# EAGLE design arm_pcb2020 (EAGLE 9.4.2)
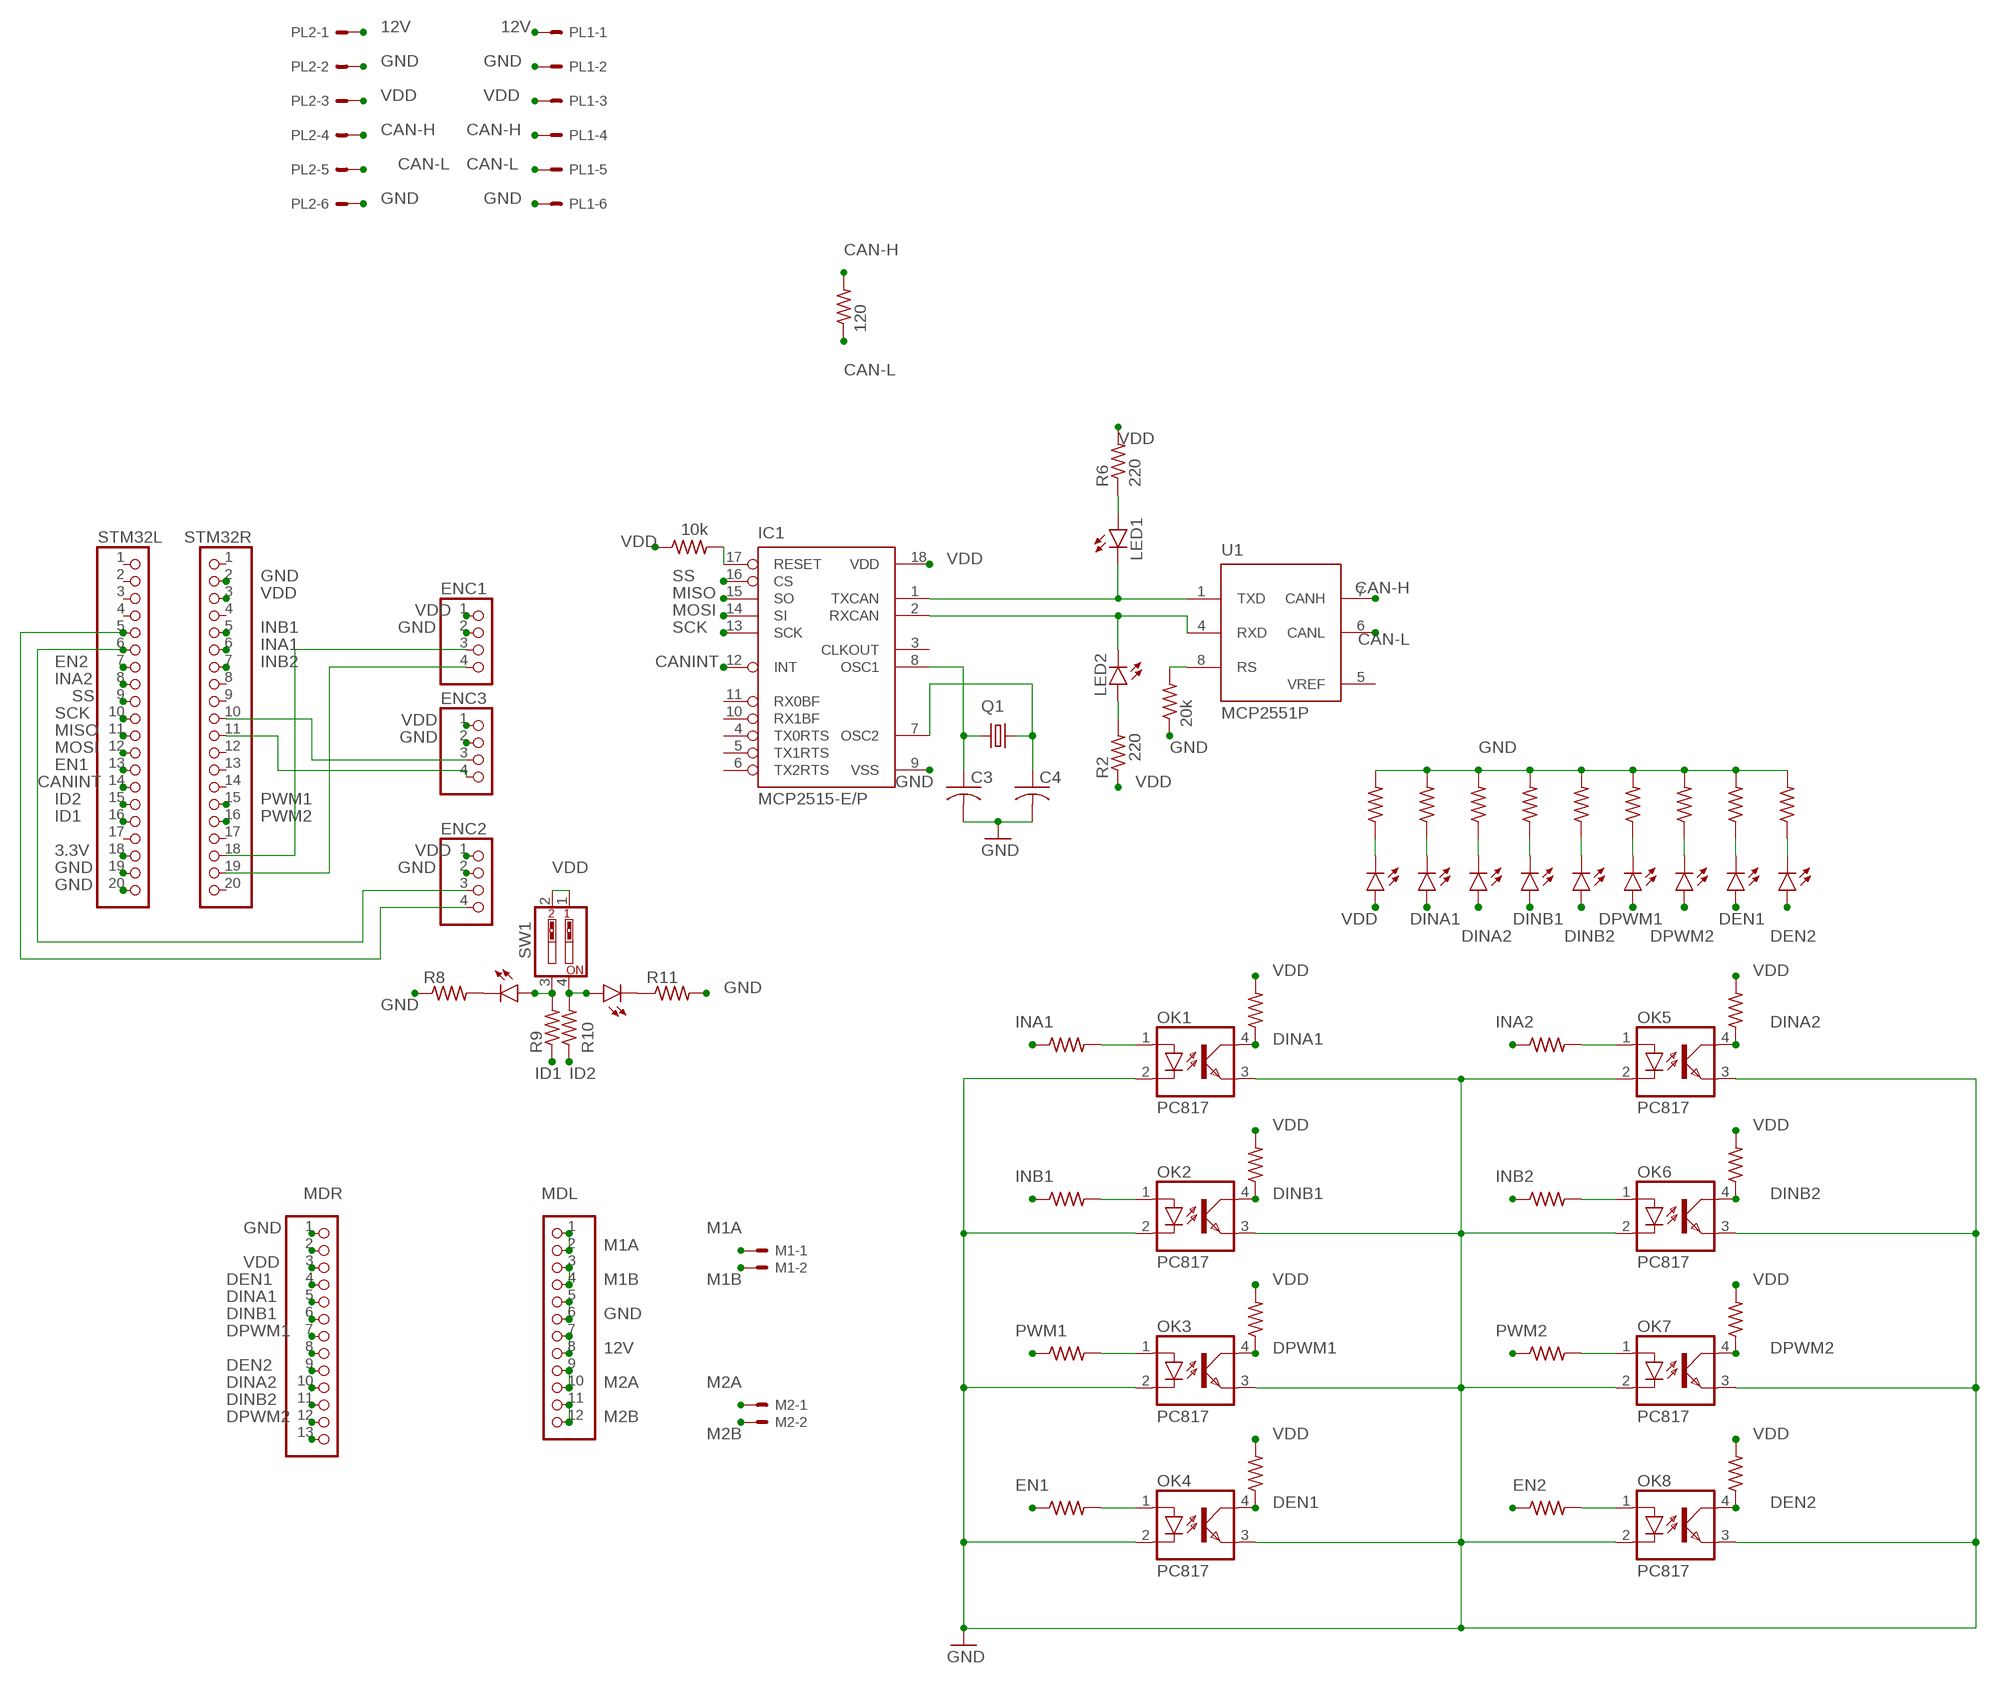
[diagram p0: schematic, sheet 1]

## Parts
C3  C-US025-024X044  [C025-024X044]
C4  C-US025-024X044  [C025-024X044]
ENC1  PINHD-1X4  [1X04]
ENC2  PINHD-1X4  [1X04]
ENC3  PINHD-1X4  [1X04]
IC1  MCP2515-E/P  [DIL18]
JP2  MDL  PINHD-1X12  [1X12]
LED1  LEDSMT1206  [1206]
LED2  LEDSMT1206  [1206]
LED7  LEDSMT1206  [1206]
LED8  LEDSMT1206  [1206]
LED10  LEDSMT1206  [1206]
LED11  LEDSMT1206  [1206]
LED12  LEDSMT1206  [1206]
LED13  LEDSMT1206  [1206]
LED14  LEDSMT1206  [1206]
LED15  LEDSMT1206  [1206]
LED16  LEDSMT1206  [1206]
LED17  LEDSMT1206  [1206]
LED18  LEDSMT1206  [1206]
M1  22-23-2021  [22-23-2021]
M2  22-23-2021  [22-23-2021]
MDR  MDR  PINHD-1X13  [1X13]
OK1  PC817  [DIL04]
OK2  PC817  [DIL04]
OK3  PC817  [DIL04]
OK4  PC817  [DIL04]
OK5  PC817  [DIL04]
OK6  PC817  [DIL04]
OK7  PC817  [DIL04]
OK8  PC817  [DIL04]
PL1  555X-6V  [5566-6]
PL2  555X-6V  [5566-6]
Q1  CRYSTALHC49U-V  [HC49U-V]
R2  220  R-US_R0805  [R0805]
R3  120  R-US_0207/9  [0207/9]
R4  R-US_R0805  [R0805]
R5  R-US_R0805  [R0805]
R6  220  R-US_R0805  [R0805]
R7  R-US_R0805  [R0805]
R8  R-US_R0805  [R0805]
R9  R-US_R0805  [R0805]
R10  R-US_R0805  [R0805]
R11  R-US_R0805  [R0805]
R12  R-US_R0805  [R0805]
R13  R-US_R0805  [R0805]
R14  R-US_R0805  [R0805]
R15  R-US_R0805  [R0805]
R16  R-US_R0805  [R0805]
R17  R-US_R0805  [R0805]
R18  R-US_R0805  [R0805]
R19  R-US_R0805  [R0805]
R20  R-US_R0805  [R0805]
R21  R-US_R0805  [R0805]
R22  R-US_R0805  [R0805]
R23  R-US_R0805  [R0805]
R24  R-US_R0805  [R0805]
R25  R-US_R0805  [R0805]
R26  R-US_R0805  [R0805]
R27  R-US_R0805  [R0805]
R28  R-US_R0805  [R0805]
R29  R-US_R0805  [R0805]
R33  R-US_R0805  [R0805]
R34  R-US_R0805  [R0805]
R37  R-US_R0805  [R0805]
R38  R-US_R0805  [R0805]
R39  10k  R-US_0207/10  [0207/10]
R40  20k  R-US_0207/10  [0207/10]
STM32L  PINHD-1X20  [1X20]
STM32R  PINHD-1X20  [1X20]
SW1  SW_DIP-2  [EDG-02]
U1  MCP2551P  [DIL8]

## Nets
3.3V: STM32L.18
12V: JP2.7 JP2.8 PL1.1 PL2.1
CAN-H: PL1.4 PL2.4 R3.2 U1.7(CANH)
CAN-L: PL1.5 PL2.5 R3.1 U1.6(CANL)
CANINT: IC1.12(INT) STM32L.14
DEN1: LED17.A MDR.4 OK4.4(COL) R13.1
DEN2: LED18.A MDR.9 OK8.4(COL) R26.1
DINA1: LED11.A MDR.5 OK1.4(COL) R4.1
DINA2: LED12.A MDR.10 OK5.4(COL) R29.1
DINB1: LED13.A MDR.6 OK2.4(COL) R5.1
DINB2: LED14.A MDR.11 OK6.4(COL) R28.1
DPWM1: LED15.A MDR.7 OK3.4(COL) R12.1
DPWM2: LED16.A MDR.12 OK7.4(COL) R27.1
EN1: R23.1 STM32L.13
EN2: R38.1 STM32L.7
GND: C3.2 C4.2 ENC1.2 ENC2.2 ENC3.2 IC1.9(VSS) JP2.5 JP2.6 MDR.1 OK1.2(C) OK1.3(EMIT) OK2.2(C) OK2.3(EMIT) OK3.2(C) OK3.3(EMIT) OK4.2(C) OK4.3(EMIT) OK5.2(C) OK5.3(EMIT) OK6.2(C) OK6.3(EMIT) OK7.2(C) OK7.3(EMIT) OK8.2(C) OK8.3(EMIT) PL1.2 PL1.6 PL2.2 PL2.6 R8.1 R11.2 R14.2 R15.2 R16.2 R17.2 R18.2 R19.2 R20.2 R33.2 R34.2 R40.1 STM32L.19 STM32L.20 STM32R.2
ID1: R9.1 STM32L.16
ID2: R10.1 STM32L.15
INA1: R7.1 STM32R.6
INA2: R24.1 STM32L.8
INB1: R21.1 STM32R.5
INB2: R25.1 STM32R.7
M1A: JP2.1 JP2.2 M1.1
M1B: JP2.3 JP2.4 M1.2
M2A: JP2.9 JP2.10 M2.1
M2B: JP2.11 JP2.12 M2.2
MISO: IC1.15(SO) STM32L.11
MOSI: IC1.14(SI) STM32L.12
N$1: IC1.1(TXCAN) LED1.C U1.1(TXD)
N$2: R40.2 U1.8(RS)
N$3: C4.1 IC1.7(OSC2) Q1.2
N$4: C3.1 IC1.8(OSC1) Q1.1
N$5: LED11.C R15.1
N$6: ENC1.4 STM32R.19
N$7: OK1.1(A) R7.2
N$8: LED12.C R16.1
N$9: IC1.17(RESET) R39.2
N$10: LED7.A R9.2 SW1.3
N$11: LED8.A R10.2 SW1.4
N$12: LED8.C R11.1
N$13: LED7.C R8.2
N$14: LED13.C R17.1
N$15: ENC2.4 STM32L.5
N$16: OK2.1(A) R21.2
N$17: LED10.C R14.1
N$18: LED14.C R18.1
N$19: LED15.C R19.1
N$20: LED16.C R20.1
N$21: LED17.C R33.1
N$22: ENC2.3 STM32L.6
N$23: ENC1.3 STM32R.18
N$24: LED18.C R34.1
N$25: ENC3.3 STM32R.10
N$28: MDR.2
N$29: LED2.A R2.2
N$31: ENC3.4 STM32R.11
N$34: MDR.8
N$37: LED1.A R6.1
N$38: IC1.2(RXCAN) LED2.C U1.4(RXD)
N$39: MDR.13
N$40: OK3.1(A) R22.2
N$41: OK4.1(A) R23.2
N$47: OK5.1(A) R24.2
N$48: OK6.1(A) R25.2
N$49: OK7.1(A) R37.2
N$50: OK8.1(A) R38.2
PWM1: R22.1 STM32R.15
PWM2: R37.1 STM32R.16
SCK: IC1.13(SCK) STM32L.10
SS: IC1.16(CS) STM32L.9
VDD: ENC1.1 ENC2.1 ENC3.1 IC1.18(VDD) LED10.A MDR.3 PL1.3 PL2.3 R2.1 R4.2 R5.2 R6.2 R12.2 R13.2 R26.2 R27.2 R28.2 R29.2 R39.1 STM32R.3 SW1.1 SW1.2
Unconnected: IC1.3(CLKOUT) IC1.4(TX0RTS) IC1.5(TX1RTS) IC1.6(TX2RTS) IC1.10(RX1BF) IC1.11(RX0BF) STM32L.1 STM32L.2 STM32L.3 STM32L.4 STM32L.17 STM32R.1 STM32R.4 STM32R.8 STM32R.9 STM32R.12 STM32R.13 STM32R.14 STM32R.17 STM32R.20

## Power pins joined to a net without a drawn wire
VDD: U1.3(VDD)
VREF: U1.5(VREF)
VSS: U1.2(VSS)

## Library data of the parts
C3 C4 = adafruit:C-US: CAPACITOR, American symbol
ENC1-ENC3 = pinhead:PINHD-1X4: PIN HEADER
IC1 = mcp2515:MCP2515
JP2 = adafruit:PINHD-1X12: PIN HEADER
LED1 LED2 LED7 LED8 LED10-LED18 = led:LED: LED OSRAM: - CHIPLED LG R971, LG N971, LY N971, LG Q971, LY Q971, LO R971, LY R971 LH N974, LH R974 LS Q976, LO Q976, LY Q976 LO Q996 - Hyper CHIPLED LW Q18S LB Q993, LB Q99A, LB R99A - SideLED LS A670, LO A670, LY A670, LG A670, LP A670 LB A673, LV A673, LT A673, LW A673 LH A674 LY A675 LS A676, LA A676, LO A676, LY A676, LW A676 LS A679, LY A679, LG A679 - Hyper Micro SIDELED® LS Y876, LA Y876, LO Y876, LY Y876 LT Y87S - SmartLED LW L88C, LW L88S LB L89C, LB L89S, LG L890 LS L89K, LO L89K, LY L89K LS L896, LA L896, LO L896, LY L896 - TOPLED LS T670, LO T670, LY T670, LG T670, LP T670 LSG T670, LSP T670, LSY T670, LOP T670, LYG T670 LG T671, LOG T671, LSG T671 LB T673, LV T673, LT T673, LW T673 LH T674 LS T676, LA T676, LO T676, LY T676, LB T676, LH T676, LSB T676, LW T676 LB T67C, LV T67C, LT T67C, LS T67K, LO T67K, LY T67K, LW E67C LS E67B, LA E67B, LO E67B, LY E67B, LB E67C, LV E67C, LT E67C LW T67C LS T679, LY T679, LG T679 LS T770, LO T770, LY T770, LG T770, LP T770 LB T773, LV T773, LT T773, LW T773 LH T774 LS E675, LA E675, LY E675, LS T675 LS T776, LA T776, LO T776, LY T776, LB T776 LHGB T686 LT T68C, LB T68C - Hyper Mini TOPLED® LB M676 - Mini TOPLED Santana® LG M470 LS M47K, LO M47K, LY M47K Source: http://www.osram.convergy.de LUXEON: - LUMILED® LXK2-PW12-R00, LXK2-PW12-S00, LXK2-PW14-U00, LXK2-PW14-V00 LXK2-PM12-R00, LXK2-PM12-S00, LXK2-PM14-U00 LXK2-PE12-Q00, LXK2-PE12-R00, LXK2-PE12-S00, LXK2-PE14-T00, LXK2-PE14-U00 LXK2-PB12-K00, LXK2-PB12-L00, LXK2-PB12-M00, LXK2-PB14-N00, LXK2-PB14-P00, LXK2-PB14-Q00 LXK2-PR12-L00, LXK2-PR12-M00, LXK2-PR14-Q00, LXK2-PR14-R00 LXK2-PD12-Q00, LXK2-PD12-R00, LXK2-PD12-S00 LXK2-PH12-R00, LXK2-PH12-S00 LXK2-PL12-P00, LXK2-PL12-Q00, LXK2-PL12-R00 Source: www.luxeon.com KINGBRIGHT: KA-3528ASYC Source: www.kingbright.com
M1 M2 = con-molex:22-23-2021: .100" (2.54mm) Center Header - 2 Pin; MF: MOLEX; MPN: 22-23-2021; OC_FARNELL: 1462926; OC_NEWARK: 25C3832
MDR = adafruit:PINHD-1X13: PIN HEADER
OK1-OK8 = optocoupler:PC817: SHARP OPTO COUPLER; MPN: PC817X4J000F; OC_FARNELL: 9707727; OC_NEWARK: 97K7059
PL1 PL2 = anv-molex:555X-6: Mini FIT connector 6 way
Q1 = adafruit:CRYSTAL: CRYSTAL; OC_FARNELL: 1666969; OC_NEWARK: unknown
R2 R4-R29 R33 R34 R37 R38 = rcl:R-US_: RESISTOR, American symbol; SPICEPREFIX: R
R3 R39 R40 = adafruit:R-US_: RESISTOR, American symbol
STM32L STM32R = adafruit:PINHD-1X20: PIN HEADER
SW1 = special:SW_DIP-2: DIP SWITCH
U1 = microchip_can:MCP2551: High Speed CAN tranceiver

## Board
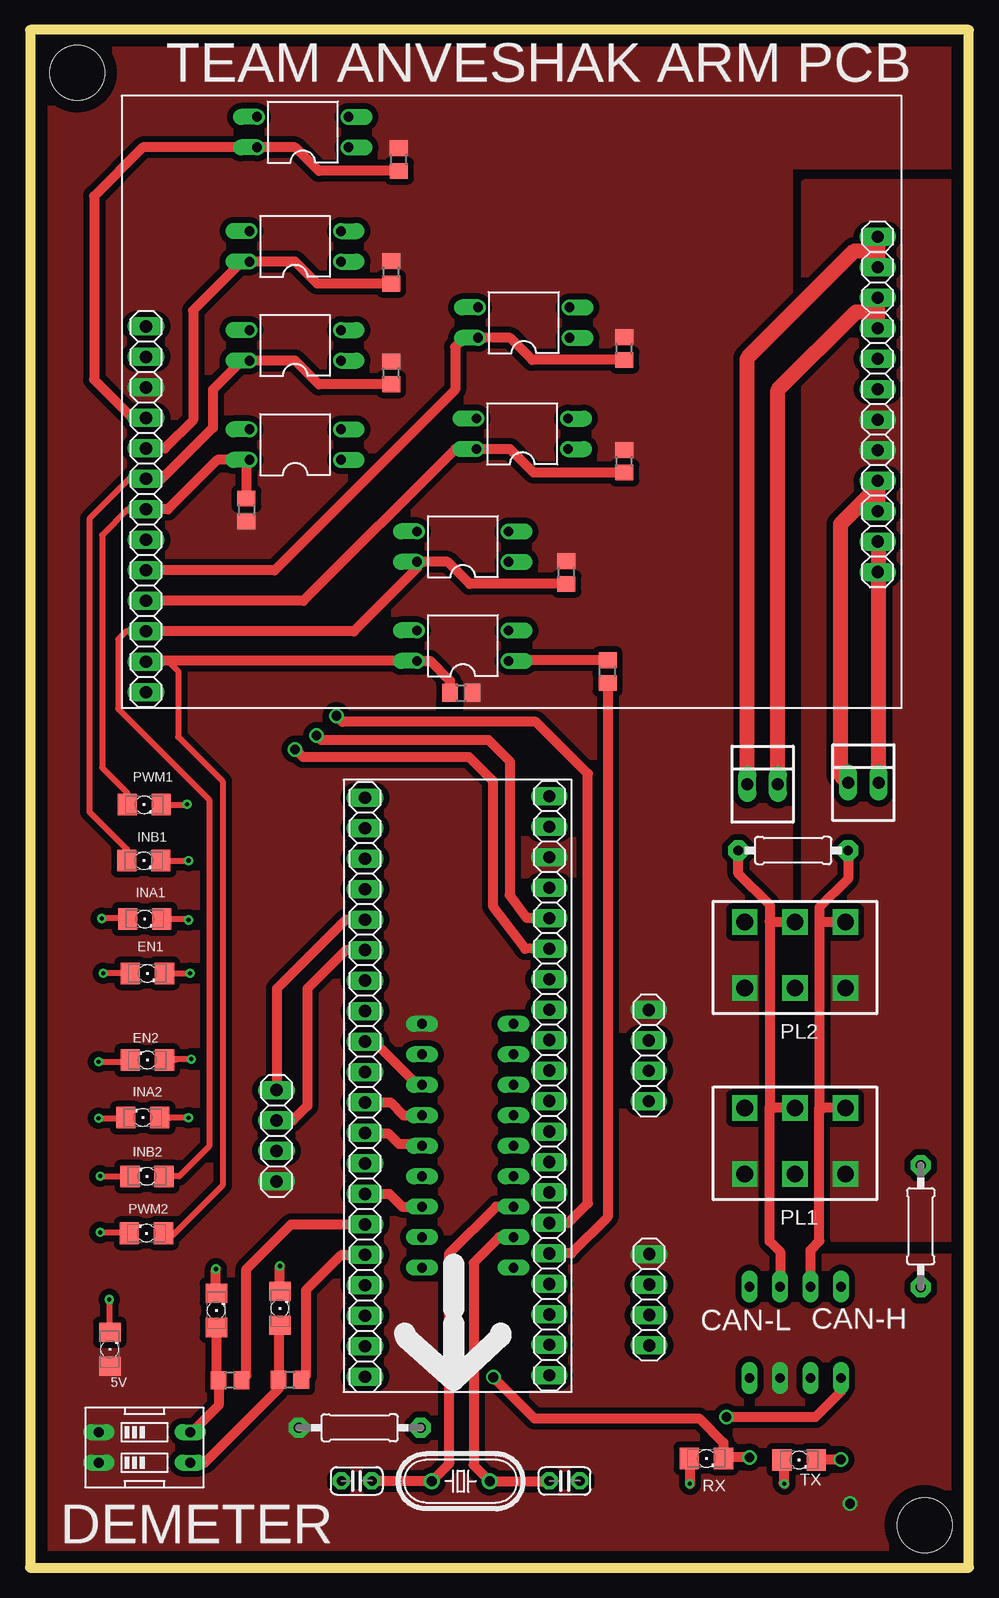
[diagram p1: board, top side]
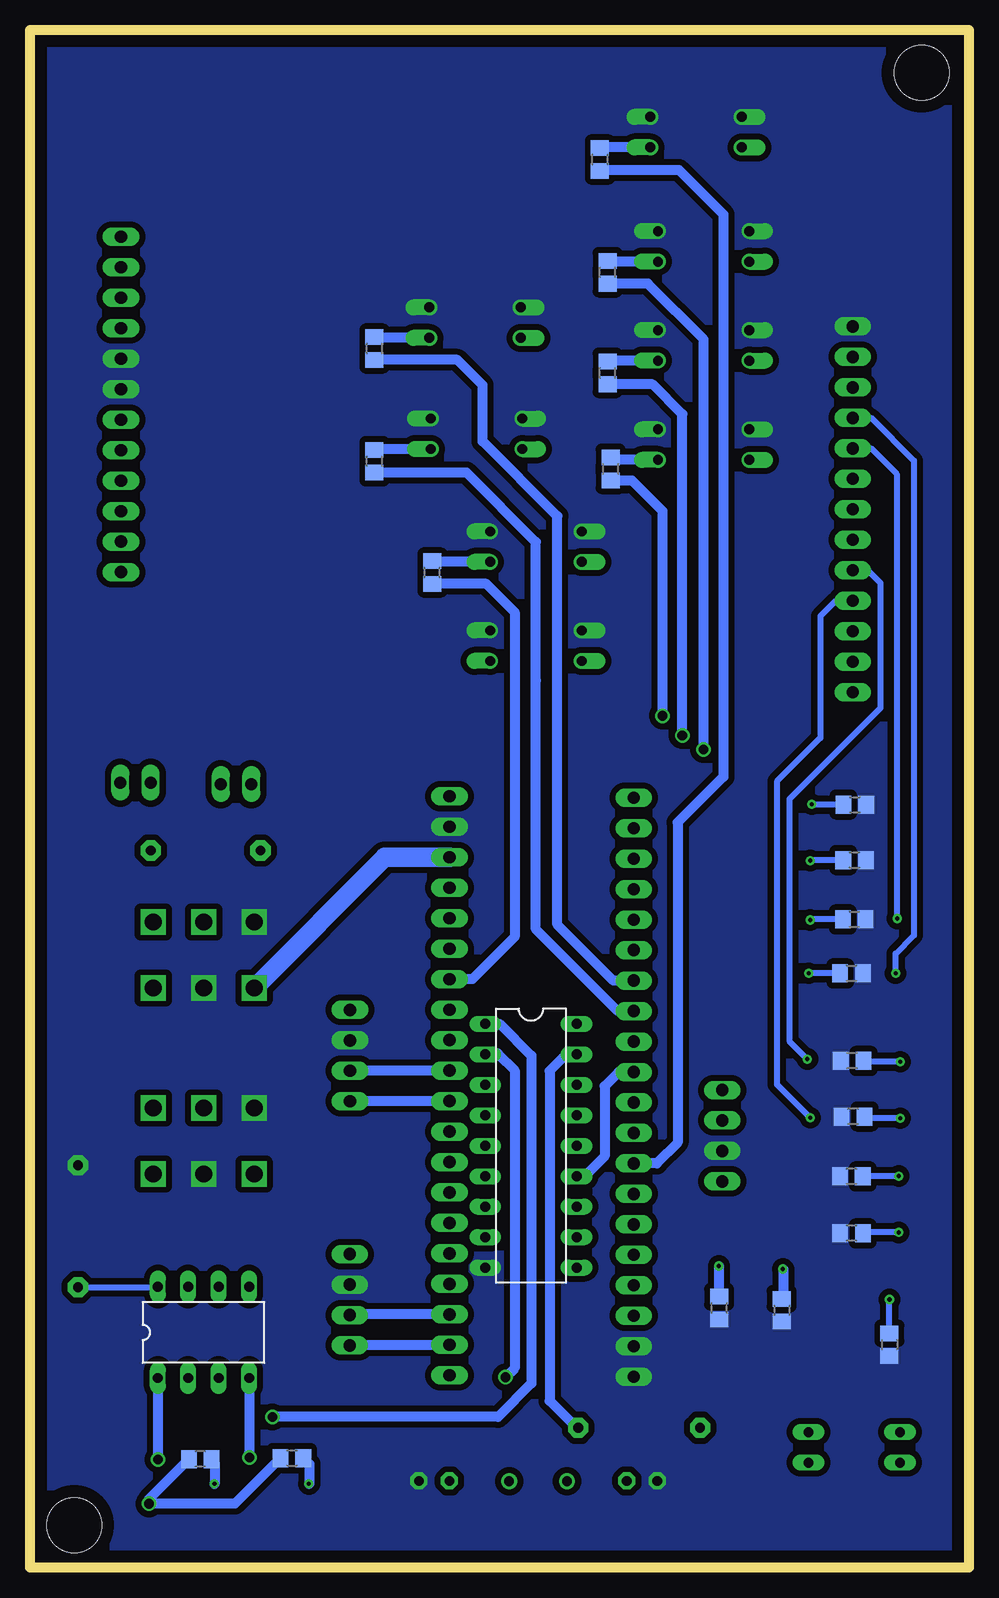
[diagram p2: board, bottom side, seen from below]

Size 78.23 x 128.14 mm. Coordinates in mm from the lower left corner, seen from the top.
Outline: 0,0 78.23,0 78.23,128.14 0,128.14 0,0
Copper layers (1*16): Top 0.035mm / dielectric 1.5mm / Bottom 0.035mm
Design rules "default *": minimum track width 6mil, minimum drill 0.35mm, track to track 20mil, track to pad 20mil, pad to pad 20mil, via to via 20mil, smd to smd 20mil, copper to edge 40mil, drill to drill 6mil, minimum pad ring 10mil, minimum via ring 8mil, stop-mask expansion 4mil, vias tented up to drill 0mil, thermal gap 10mil
Holes 4.57 mm at 74.55,3.56 3.94,124.59

### Footprints (pad centres in the part's own frame; a part is rotated, then mirrored left to right if it is on the bottom)
C025-024X044 = drill 0.813 pad 1.422 octagon: 1 -1.27,0; 2 1.27,0
1X04 = drill 1.016 long: 1 -3.81,0; 2 -1.27,0; 3 1.27,0; 4 3.81,0
DIL18 = drill 0.813 long: 1 -10.16,-3.81; 2 -7.62,-3.81; 3 -5.08,-3.81; 4 -2.54,-3.81; 5 0,-3.81; 6 2.54,-3.81; 7 5.08,-3.81; 8 7.62,-3.81; 9 10.16,-3.81; 10 10.16,3.81; 11 7.62,3.81; 12 5.08,3.81; 13 2.54,3.81; 14 0,3.81; 15 -2.54,3.81; 16 -5.08,3.81; 17 -7.62,3.81; 18 -10.16,3.81
1X12 = drill 1.016 long: 1 -13.97,0; 2 -11.43,0; 3 -8.89,0; 4 -6.35,0; 5 -3.81,0; 6 -1.27,0; 7 1.27,0; 8 3.81,0; 9 6.35,0; 10 8.89,0; 11 11.43,0; 12 13.97,0
1206 = smd 1.6 x 1.803: A -1.422,0; C 1.422,0
22-23-2021 = drill 1 long: 1 -1.27,0; 2 1.27,0
1X13 = drill 1.016 long: 1 -15.24,0; 2 -12.7,0; 3 -10.16,0; 4 -7.62,0; 5 -5.08,0; 6 -2.54,0; 7 0,0; 8 2.54,0; 9 5.08,0; 10 7.62,0; 11 10.16,0; 12 12.7,0; 13 15.24,0
DIL04 = drill 0.813 offset: 1 -1.27,-3.81; 2 1.27,-3.81; 3 1.27,3.81; 4 -1.27,3.81
5566-6 = drill 1.4 square: 1 4.2,-2.75; 2 0,-2.75; 3 -4.2,-2.75; 4 4.2,2.75; 5 0,2.75; 6 -4.2,2.75
HC49U-V = drill 0.813: 1 -2.413,0; 2 2.413,0
R0805 = smd 1.3 x 1.5: 1 -0.95,0; 2 0.95,0
0207/9 = drill 0.813 pad 1.676 octagon: 1 -4.572,0; 2 4.572,0
0207/10 = drill 0.813 pad 1.676 octagon: 1 -5.08,0; 2 5.08,0
1X20 = drill 1.016 long: 1 -24.13,0; 2 -21.59,0; 3 -19.05,0; 4 -16.51,0; 5 -13.97,0; 6 -11.43,0; 7 -8.89,0; 8 -6.35,0; 9 -3.81,0; 10 -1.27,0; 11 1.27,0; 12 3.81,0; 13 6.35,0; 14 8.89,0; 15 11.43,0; 16 13.97,0; 17 16.51,0; 18 19.05,0; 19 21.59,0; 20 24.13,0
EDG-02 = drill 0.813 long: 1 -1.27,-3.81; 2 1.27,-3.81; 3 1.27,3.81; 4 -1.27,3.81
DIL8 = drill 0.813 long: 1 -3.81,-3.81; 2 -1.27,-3.81; 3 1.27,-3.81; 4 3.81,-3.81; 5 3.81,3.81; 6 1.27,3.81; 7 -1.27,3.81; 8 -3.81,3.81

### Placement (x,y rotation side)
C3  44.55,7.23 0 top
C4  27.22,7.23 180 top
ENC1  51.59,22.33 270 top
ENC2  20.55,36 90 top
ENC3  51.56,42.67 270 top
IC1  36.49,35.16 270 bottom
JP2  70.64,96.94 270 top
LED1  64.1,8.99 0 top
LED2  56.37,9.11 0 top
LED7  20.84,21.62 90 top
LED8  15.53,21.45 90 top
LED10  6.65,18.2 90 top
LED11  9.56,54.06 0 top
LED12  9.4,37.51 180 top
LED13  9.49,58.93 0 top
LED14  9.75,32.61 180 top
LED15  9.52,63.59 0 top
LED16  9.7,27.87 180 top
LED17  9.78,49.53 0 top
LED18  9.78,42.3 180 top
M1  61.06,65.3 0 top
M2  69.44,65.42 0 top
MDR  9.66,88.2 270 top
OK1  22.1,110.11 90 top
OK2  22.1,101.85 90 top
OK3  22.1,93.6 90 top
OK4  22.73,119.63 90 top
OK5  41.02,94.49 90 top
OK6  36.07,85.09 90 top
OK7  36.07,76.84 90 top
OK8  41.15,103.76 90 top
PL1  63.75,35.56 0 top
PL2  63.75,51.05 0 top
Q1  35.9,7.21 180 top
R2  56.41,9.14 0 bottom
R3  63.6,59.77 0 top
R4  30.1,107.95 90 top
R5  30.1,99.57 90 top
R6  64.04,9.05 180 bottom
R7  30.1,107.95 90 bottom
R8  20.8,21.64 90 bottom
R9  21.65,15.65 180 top
R10  16.67,15.61 180 top
R11  15.59,21.46 270 bottom
R12  18.03,88.14 270 top
R13  30.73,117.35 90 top
R14  6.61,18.58 270 bottom
R15  9.54,54.04 0 bottom
R16  9.64,37.59 180 bottom
R17  9.51,58.97 0 bottom
R18  9.79,32.61 180 bottom
R19  9.5,63.59 0 bottom
R20  9.78,27.87 180 bottom
R21  30.1,99.57 90 bottom
R22  29.85,91.57 90 bottom
R23  30.73,117.35 90 bottom
R24  49.53,92.2 90 bottom
R25  44.7,82.93 90 bottom
R26  49.53,101.6 90 top
R27  35.94,72.9 0 top
R28  44.7,82.93 90 top
R29  49.53,92.2 90 top
R33  9.78,49.54 0 bottom
R34  9.72,42.24 180 bottom
R37  48.13,74.68 90 top
R38  49.53,101.6 90 bottom
R39  27.47,11.66 0 top
R40  74.23,28.45 270 top
STM32L  27.91,40.04 270 top
STM32R  43.27,40.16 270 top
SW1  9.54,10.02 270 top
U1  63.77,19.61 0 bottom

### Tracks (layer width: path | path; a pad name or v marks a point on that pad's centre or on a via)
12V
  pour Top (no thermals): 81.14,115.29 64.63,115.29 64.63,27.56 81.14,27.56
CAN-H
  Top 0.813: R3.2 68.17,57.4 65.79,55.02 65.79,53.72 | 65.79,53.72 65.79,38.35 | 65.79,38.35 65.79,27.21 65.05,26.47 U1.7 | 65.79,38.35 65.96,38.18 | 65.79,38.35 67.91,38.35 PL1.4 | PL2.4 65.87,53.8 65.79,53.72
CAN-L
  Top 0.813: 61.64,53.85 61.64,55.23 59.02,57.84 R3.1 | 61.64,53.85 61.64,38.35 | 61.64,38.35 61.64,27.2 62.51,26.34 U1.6 | 61.82,38.18 61.64,38.35 | 61.64,38.35 63.71,38.35 PL1.5 | PL2.5 61.69,53.8 61.64,53.85
CANINT
  Top 0.813: STM32L.14 29.94,31.15 31,30.08 IC1.12
DEN1  (via drill 0.35)
  Top 0.508: v6.1,49.53 LED17.A
  Top 0.813: 9.96,95.82 MDR.4 8.52,95.82 5.33,99 5.33,114.3 9.4,118.36 OK4.4 22.1,118.36 24.06,116.4 R13.1
  Bottom 0.508: MDR.4 8.14,95.82 4.57,92.25 4.57,52.7 6.1,51.18 v6.1,49.53
  Bottom 0.813: 8.58,95.82 MDR.4
DEN2  (via drill 0.35)
  Top 0.508: 11.46,42.05 11.5,42.05 11.5,42.39 12.19,42.39 | v13.45,42.39 12.19,42.39 | 12.19,42.39 12.1,42.3 LED18.A
  Top 0.813: MDR.9 20.38,83.12 35.43,98.17 35.43,101.73 36.2,102.49 OK8.4 40.01,102.49 41.84,100.65 R26.1
  Bottom 0.508: MDR.9 8.42,83.12 7.37,82.07 7.37,71.62 14.95,64.04 14.95,43.89 v13.45,42.39
  Bottom 0.813: MDR.9 9.73,83.19
DINA1  (via drill 0.35)
  Top 0.508: MDR.5 9.27,93.28 | v5.97,54.1 8.1,54.1 LED11.A
  Top 0.813: OK1.4 18.29,108.71 | OK1.4 17.65,108.84 13.59,104.78 13.59,95.63 11.23,93.28 MDR.5 | R4.1 23.94,107 22.1,108.84 OK1.4
  Bottom 0.508: MDR.5 8.14,93.28 6.02,91.15 6.02,54.14 v5.98,54.1 v5.97,54.1
  Bottom 0.813: MDR.5 9.75,93.37
DINA2  (via drill 0.35)
  Top 0.508: v13.21,37.49 11.68,37.49 11.09,37.49 10.84,37.49 LED12.A
  Top 0.813: MDR.10 22.79,80.58 35.43,93.22 OK5.4 40.01,93.22 41.97,91.25 R29.1
  Bottom 0.508: MDR.10 11.09,80.58 12.37,79.29 12.37,69.16 16,65.53 16,40.29 v13.21,37.49
DINB1
  Top 0.508: 8.97,90.73 MDR.6 8.29,90.73 4.95,87.4 4.95,62.99 8.06,59.88 LED13.A
  Top 0.813: MDR.6 10.98,90.73 15.24,95 15.24,98.17 17.65,100.58 OK2.4 22.1,100.58 24.06,98.62 R5.1
DINB2
  Top 0.508: MDR.11 8.02,78.04 7.35,77.37 7.35,71.59 14.94,64.01 14.94,35.11 12.43,32.61 LED14.A
  Top 0.813: MDR.11 26.98,78.04 32.26,83.31 OK6.4 34.8,83.82 36.64,81.98 R28.1
DPWM1
  Top 0.508: MDR.7 8.16,88.2 6.02,86.05 6.02,66.68 8.09,64.6 LED15.A
  Top 0.813: MDR.7 11.49,88.2 15.62,92.33 OK3.4 18.03,92.33 R12.1
  Bottom 0.508: MDR.7 9.93,88.2
DPWM2
  Top 0.508: MDR.12 11.57,75.5 12.35,74.71 12.35,69.23 16.05,65.53 16.05,31.86 11.94,27.75 11.25,27.75 LED16.A
  Top 0.813: OK7.4 9.73,75.57 MDR.12 | OK7.4 32.34,75.64 | OK7.4 33.34,75.57 34.99,73.91 R27.1
EN1
  Bottom 0.813: R23.1 30.67,116.46 24.13,116.46 20.45,112.78 20.45,65.91 24.26,62.1 24.26,35.43 26,33.69 STM32L.13
EN2
  Bottom 0.813: STM32L.7 29.62,48.93 34.29,53.59 34.29,87.63 40.51,93.85 40.51,98.55 42.61,100.65 R38.1
GND
  pour Bottom (no thermals): -12.44,129.16 80.14,129.16 80.14,-4.43 -12.44,-4.43
ID1
  Top 0.813: R9.1 22.99,16.03 22.99,23.11 25.94,26.07 STM32L.16
ID2
  Top 0.508: 17.62,16.13 R10.1 17.5,15.49
  Top 0.813: R10.1 18.03,16.02 18.03,24.89 21.75,28.61 STM32L.15
INA1  (via drill 0.8)
  Top 0.813: STM32R.6 43.26,51.6 41.27,51.58 38.57,55.13 38.57,65.57 36.58,67.56 22.73,67.56 v22.1,68.2
  Bottom 0.813: v22.1,68.2 22.1,102.36 26.74,107 R7.1
INA2
  Bottom 0.813: STM32L.8 29.24,46.39 36.07,53.21 36.07,73.91 36.07,85.47 41.85,91.25 R24.1
INB1  (via drill 0.8)
  Top 0.813: STM32R.5 41.41,54.13 39.97,56.04 39.97,67.22 38.23,68.96 24.26,68.96 v23.88,69.34
  Bottom 0.813: v23.88,69.34 23.88,96.14 26.36,98.62 R21.1
INB2
  Bottom 0.813: R25.1 40.2,81.98 37.85,79.63 37.85,52.58 41.38,49.05 STM32R.7
M1A
  Top 1.016: 59.79,98.9 M1.1
  Top 1.27: M1.1 59.79,100.81 68.71,109.73 70.64,109.73 | JP2.1 70.64,109.73 | 70.64,109.73 JP2.2
M1B
  Top 0.813: JP2.3 70.64,104.9
  Top 1.27: JP2.4 70.64,104.78 70.52,104.78 | 70.52,104.78 70.52,104.65 68.83,104.65 62.33,98.14 M1.2 | 70.52,104.78 70.52,105.03 70.64,104.9
M2A
  Top 1.27: JP2.9 70.64,89.54 | 70.64,89.54 JP2.10 70.6,88.01 | M2.1 67.53,66.06 67.53,86.97 70.1,89.54 70.64,89.54
M2B
  Top 0.813: JP2.11 JP2.12
  Top 1.27: M2.2 70.71,85.44 JP2.11
MISO
  Top 0.813: IC1.15 31.12,37.7 30.05,38.77 STM32L.11
MOSI
  Top 0.813: STM32L.12 27.95,36.2 29.85,36.2 30.75,35.29 32.55,35.29 IC1.14
N$1  (via drill 0.8)
  Top 0.813: LED1.C 67.53,8.99 v67.56,9.02 | U1.1 67.58,14.69 65.47,12.57 v58.04,12.57
  Bottom 0.813: U1.1 67.58,9.04 v67.56,9.02 | 58.17,12.57 v58.04,12.57 39.23,12.57 36.45,15.35 36.45,42.67 39.1,45.32 IC1.1
N$2
  Bottom 0.508: R40.2 67.58,23.37 U1.8
N$3
  Top 0.508: 28.52,7.21 C4.1
  Top 0.813: 28.52,7.21 Q1.2 34.92,8.65 34.92,8.89 34.91,8.9 34.91,26.15 38.84,30.08 IC1.7
N$4
  Top 0.508: 43.26,7.21 C3.1
  Top 0.813: 43.26,7.21 Q1.1 36.96,8.56 36.96,25.4 39.1,27.54 IC1.8
N$5  (via drill 0.35)
  Top 0.508: LED11.C 13.12,54.06 v13.21,53.98
  Bottom 0.508: R15.1 13.15,54.04 v13.21,53.98
N$6
  Bottom 0.813: 43.53,18.31 STM32R.19 43.27,18.52 ENC1.4
N$7
  Bottom 0.813: OK1.1 30.04,108.84 R7.2
N$8  (via drill 0.35)
  Top 0.508: v5.71,37.46 7.94,37.46 LED12.C
  Bottom 0.508: v5.71,37.46 8.56,37.46 R16.1
N$9
  Bottom 0.813: IC1.17 33.55,42.78 34.92,41.4 34.92,13.91 32.68,11.66 R39.2
N$10
  Top 0.508: 20.71,15.64 R9.2
  Top 0.813: R9.2 20.7,14.88 14.57,8.75 SW1.3 | LED7.A 20.71,20.07 20.71,15.64
N$11
  Top 0.508: LED8.A 15.23,19.72
  Top 0.813: SW1.4 13.48,11.29 15.72,13.53 R10.2 15.53,15.8 LED8.A
N$12  (via drill 0.35)
  Top 0.813: LED8.C 15.49,22.91 v15.49,24.89
  Bottom 0.813: v15.49,24.89 15.46,24.86 15.46,22.54 R11.1
N$13  (via drill 0.35)
  Top 0.813: LED7.C v20.83,25.15
  Bottom 0.508: R8.2 20.91,22.49
  Bottom 0.813: v20.83,25.15 20.83,22.62 R8.2
N$14  (via drill 0.35)
  Top 0.508: LED13.C v13.21,58.93
  Bottom 0.508: R17.1 13.17,58.97 v13.21,58.93
N$15
  Top 0.813: STM32L.5 26.32,54.01 20.57,48.26 20.57,39.81 ENC2.4
N$16
  Bottom 0.813: OK2.1 30.03,100.58 R21.2
N$17  (via drill 0.35)
  Top 0.508: v6.6,22.35 6.6,19.68 LED10.C
  Bottom 0.508: R14.1 v6.61,22.35 v6.6,22.35
N$18  (via drill 0.35)
  Top 0.508: v5.84,32.64 8.29,32.64 LED14.C
  Bottom 0.508: v5.84,32.64 8.8,32.64 R18.1
N$19  (via drill 0.35)
  Top 0.508: LED15.C 13.04,63.59 v13.08,63.63
  Bottom 0.508: R19.1 13.04,63.59 v13.08,63.63
N$20  (via drill 0.35)
  Top 0.508: v5.84,27.94 8.21,27.94 LED16.C
  Bottom 0.508: v5.84,27.94 8.75,27.94 R20.1
N$21  (via drill 0.35)
  Top 0.508: LED17.C v13.33,49.53 v13.34,49.53
  Bottom 0.508: R33.1 v13.33,49.54 v13.34,49.53
N$22
  Top 0.813: STM32L.6 26.32,51.47 23.11,48.26 23.11,38.48 21.9,37.27 ENC2.3
N$23
  Bottom 0.813: STM32R.18 51.54,21.11 ENC1.3
N$24  (via drill 0.35)
  Top 0.508: v5.71,42.16 8.22,42.16 LED18.C
  Bottom 0.508: v5.71,42.16 8.69,42.16 R34.1
N$25
  Bottom 0.813: STM32R.10 51.54,41.43 ENC3.3
N$29  (via drill 0.35)
  Top 0.508: 54.96,9.11 LED2.A
  Top 0.813: LED2.A 54.99,9.06 v54.99,6.98
  Bottom 0.508: R2.2 55.34,9.02
  Bottom 0.813: R2.2 54.95,8.63 54.95,7.02 v54.99,6.98
N$31
  Bottom 0.813: ENC3.4 51.54,38.89 STM32R.11
N$37  (via drill 0.35)
  Top 0.508: LED1.A 62.71,9.02
  Top 0.813: v62.87,6.98 62.8,7.05 62.8,8.86 LED1.A
  Bottom 0.508: R6.1 62.68,8.64
  Bottom 0.813: R6.1 62.84,8.8 62.84,7.01 v62.87,6.98
N$38  (via drill 0.8)
  Top 0.508: 57.87,9.2 LED2.C
  Top 0.813: v59.95,9.2 57.87,9.2 | v38.61,15.88 42.04,12.45 55.77,12.45 57.79,10.43 LED2.C
  Bottom 0.508: 59.95,9.53 v59.95,9.2
  Bottom 0.813: U1.4 59.97,9.54 | 59.95,9.53 59.97,9.54 | IC1.2 40.27,42.78 40.22,42.83 39.24,42.83 37.85,41.44 37.85,16.64 v38.61,15.88 | 59.97,9.54 59.97,9.21 v59.95,9.2
N$40
  Bottom 0.813: OK3.1 29.66,92.33 R22.2
N$41
  Bottom 0.813: OK4.1 30.67,118.36 R23.2
N$47
  Bottom 0.813: OK5.1 49.46,93.22 R24.2
N$48
  Bottom 0.813: OK6.1 44.64,83.82 R25.2
N$49
  Top 0.813: R37.2 39.94,75.63 OK7.1
N$50
  Bottom 0.813: OK8.1 49.47,102.49 R38.2
PWM1  (via drill 0.8)
  Top 0.813: v25.53,70.99 26.04,70.48 42.16,70.48 46.48,66.17 46.48,30.35 44.86,28.73 STM32R.15
  Bottom 0.813: R22.1 28.07,90.62 25.53,88.08 v25.53,70.99
PWM2
  Top 0.813: R37.1 48.13,29.21 45.11,26.19 STM32R.16
SCK
  Bottom 0.813: STM32L.10 29.18,41.31 30.35,40.13 30.35,34.29 32.02,32.62 IC1.13
SS
  Top 0.813: STM32L.9 28.67,43.85 32.27,40.24 IC1.16
VDD  (via drill 0.8)
  Bottom 0.813: R2.1 61.16,5.33 v68.33,5.33 68.33,5.72 R6.2
  Bottom 1.626: STM32R.3 48.65,59.21 PL2.3
  pour Top (no thermals): -6.71,129.66 81.14,129.66 81.14,116.93 63.13,116.93 63.13,25.8 81.14,25.8 81.14,-7.08 -6.71,-7.08

### Text on the board
tPlace: CAN-L | CAN-H
tNames: TEAM ANVESHAK ARM PCB | PWM1 | INB1 | INA1 | EN1 | EN2 | INA2 | INB2 | PWM2 | 5V | TX | RX | DEMETER